# EAGLE design BP_demo_v5b (EAGLE 5.11)
OPT1: I2C; OPT2: SPI; OPT3: UART; OPT4: ____; PROJECT: Bus Pirate Demo Board v5b
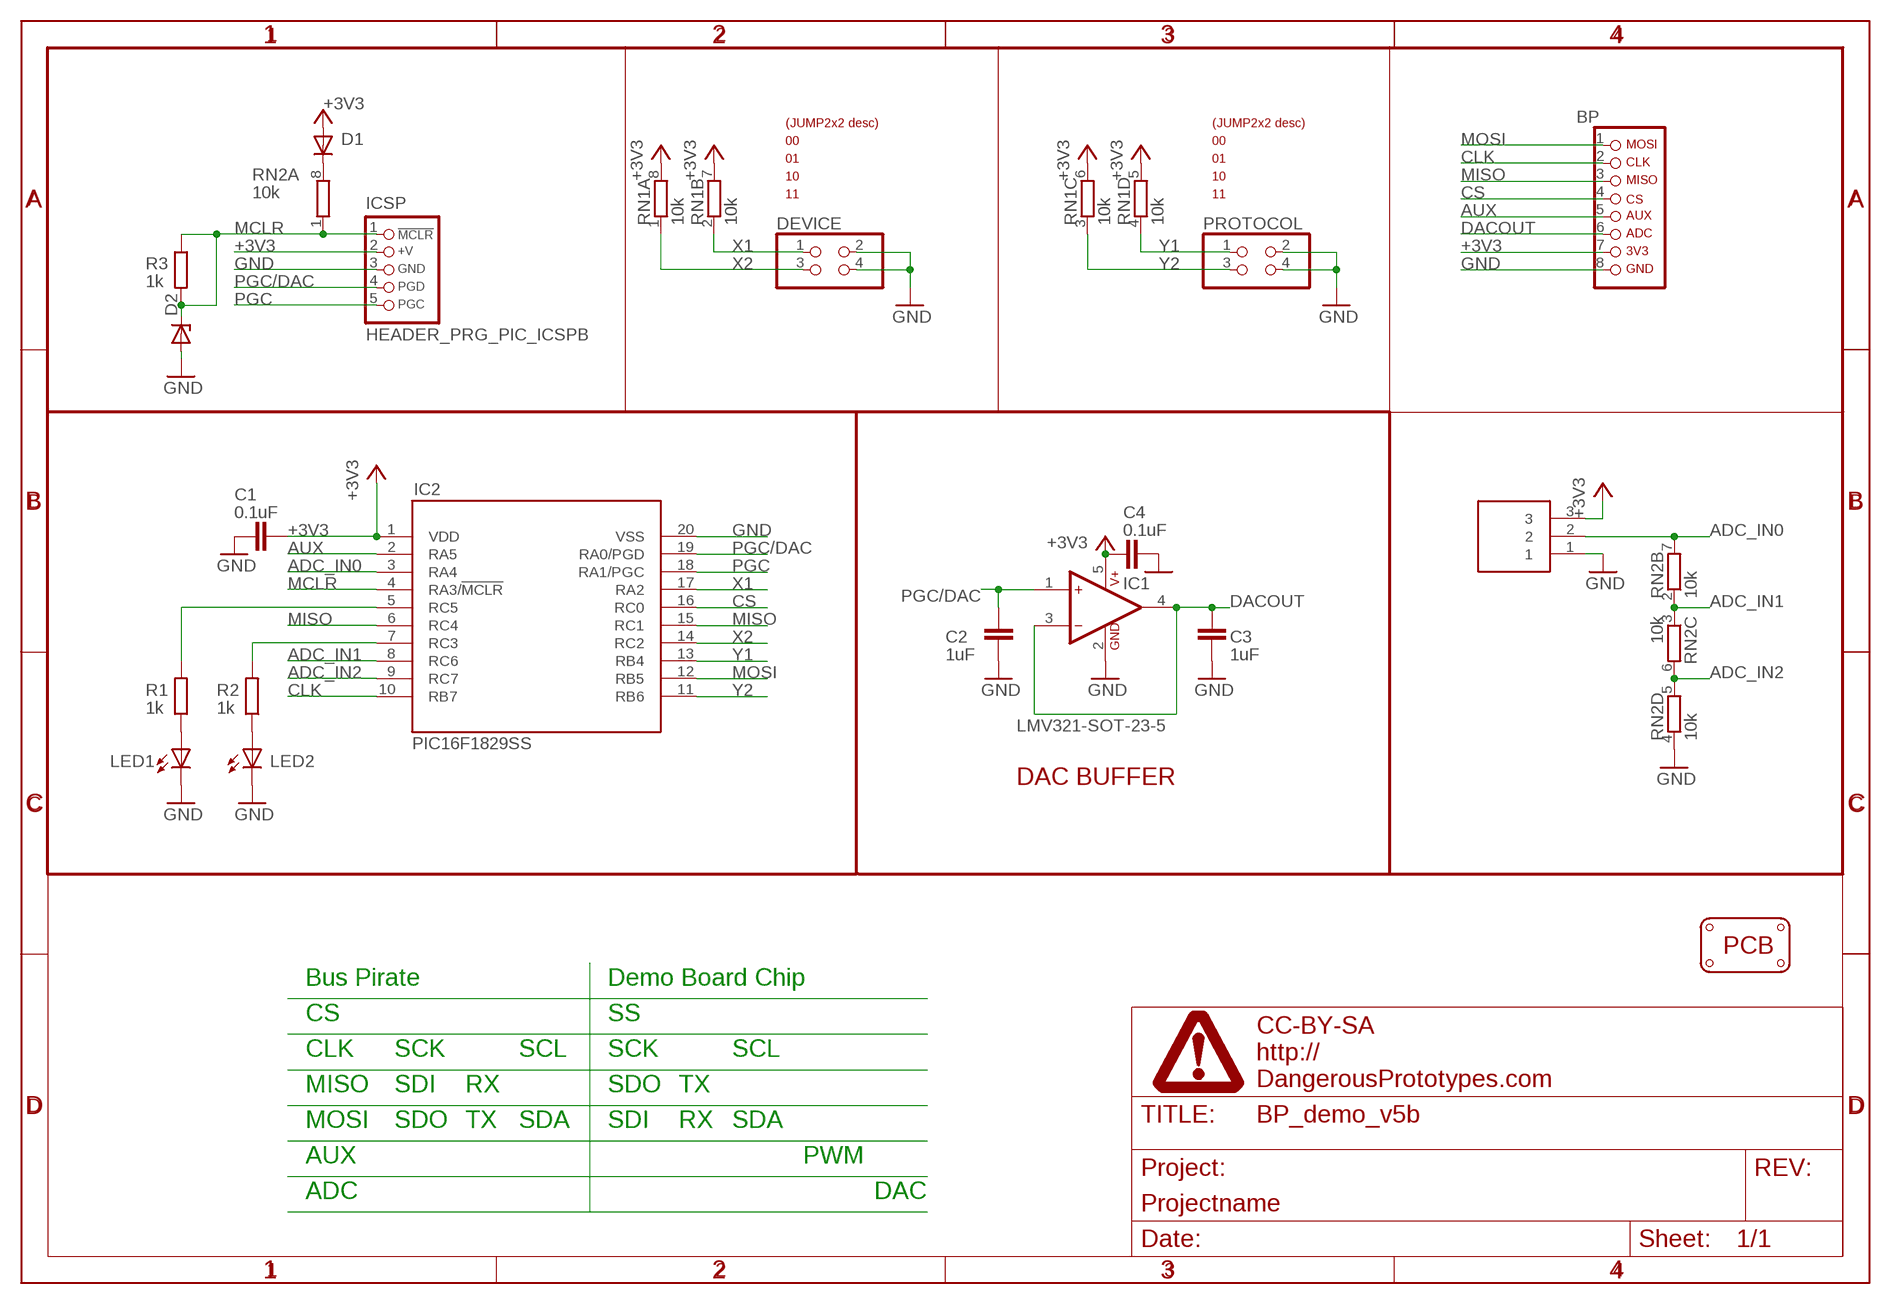
[diagram p0: schematic, sheet 1]

## Parts
ADC_IN  HEADER1X3PTH  [M1X3]
BP  HDR-BUSPIRATE  [HDR-BUSPIRATE]
C1  0.1uF  CAPC603  [C603]
C2  1uF  CAPC603  [C603]
C3  1uF  CAPC603  [C603]
C4  0.1uF  CAPC603  [C603]
D1  DIODE-DO323  [DO323]
D2  ZENERSOD-323F  [SOD-323F]
DEVICE  PINHD-2X2  [2X02]
IC1  LMV321-SOT-23-5  [SOT-23-5]
IC2  PIC16F1829SS  [SSOP20]
ICSP  HEADER_PRG_PIC_ICSPB  [HEADER_PRG_1X05_ICSP_B]
LED1  LED805  [LED-805]
LED2  LED805  [LED-805]
PCB1  PCB_DP_RECTANGLE-37X60  [DP6037_V1]
PROTOCOL  PINHD-2X2  [2X02]
R1  1k  RESISTORR603  [R603]
R2  1k  RESISTORR603  [R603]
R3  1k  RESISTORR603  [R603]
RN1  10k  RNETWORK  [RN8P-4R-CRA06S]
RN2  10k  RNETWORK  [RN8P-4R-CRA06S]
U$2  DINA4_L  [DP_LOGO]
U$3  JUMP2X2_DESC  [JUMP2X2_DESC]
U$4  JUMP2X2_DESC  [JUMP2X2_DESC]

## Nets
+3V3: ADC_IN.3 BP.7 C1.1 C4.1 D1.A IC1.5(V+) IC2.1(VDD) ICSP.2(+V) RN1.5 RN1.6 RN1.7 RN1.8
ADC_IN0: ADC_IN.2 IC2.3(RA4) RN2.7
ADC_IN1: IC2.8(RC6) RN2.2 RN2.3
ADC_IN2: IC2.9(RC7) RN2.5 RN2.6
AUX: BP.5 IC2.2(RA5)
CLK: BP.2 IC2.10(RB7)
CS: BP.4 IC2.16(RC0)
DACOUT: BP.6 C3.1 IC1.3(-) IC1.4(OUT)
GND: ADC_IN.1 BP.8 C1.2 C2.1 C3.2 C4.2 D2.A DEVICE.2 DEVICE.4 IC1.2(GND) IC2.20(VSS) ICSP.3(GND) LED1.C LED2.C PROTOCOL.2 PROTOCOL.4 RN2.4
MCLR: D2.C IC2.4(RA3/!MCLR) ICSP.1(/MCLR) R3.1 R3.2 RN2.1
MISO: BP.3 IC2.6(RC4) IC2.15(RC1)
MOSI: BP.1 IC2.12(RB5)
N$1: IC2.5(RC5) R1.2
N$2: LED1.A R1.1
N$7: LED2.A R2.1
N$10: IC2.7(RC3) R2.2
N$11: D1.C RN2.8
PGC: IC2.18(RA1/PGC) ICSP.5(PGC)
PGC/DAC: C2.2 IC1.1(+) IC2.19(RA0/PGD) ICSP.4(PGD)
X1: DEVICE.1 IC2.17(RA2) RN1.2
X2: DEVICE.3 IC2.14(RC2) RN1.1
Y1: IC2.13(RB4) PROTOCOL.1 RN1.4
Y2: IC2.11(RB6) PROTOCOL.3 RN1.3

## Notes on the sheet
- DAC BUFFER
- Bus Pirate | Demo Board Chip
- CS | SS
- CLK | SCK | SCL | SCK | SCL
- MISO | SDI | RX | SDO | TX
- MOSI | SDO | TX | SDA | SDI | RX | SDA
- AUX | PWM
- ADC | DAC

## Library data of the parts
ADC_IN = dp_devices:HEADER1X3
BP = dp_devices:HDR-BUSPIRATE: PIN HEADER
C1-C4 = dp_devices:CAP
D1 = dp_devices:DIODE: Various Diode Packages
D2 = dp_devices:ZENER: Zener Diode SOD-323
DEVICE PROTOCOL = pinhead:PINHD-2X2: PIN HEADER
IC1 = dp_devices:LMV321: Low voltage op-amp (2.7 - 5.0V)
IC2 = dp_devices:PIC16F1829
ICSP = dp_devices:HEADER_PRG_PIC_ICSP: 5-pin PIC In Circuit Serial Programming header
LED1 LED2 = dp_devices:LED
PCB1 = dp_devices:PCB_DP_RECTANGLE: Dangerous Prototypes Standard Rectangular PCB sizes
R1-R3 = dp_devices:RESISTOR
RN1 RN2 = dp_devices:RNETWORK: 4 Resistor Array 0603
U$2 = DP2:DINA4_L: A4 DP frame Standard Dangerous Prototypes schematic frame. Automagically adds the DP logo and standard texts to the PCB Use the atrribute in the schematic editor to change the fields.; FF1: fulfillment by; FF2: Seeed Studio; FF3: www.seeedstudio.com; LICENSE: CC-BY-SA; PROJECT: Projectname; URL1: http://; URL2: DangerousPrototypes.com
U$3 U$4 = DP2:JUMP2X2_DESC; OPT1: option1; OPT2: option2; OPT3: option3; OPT4: option4

## Board
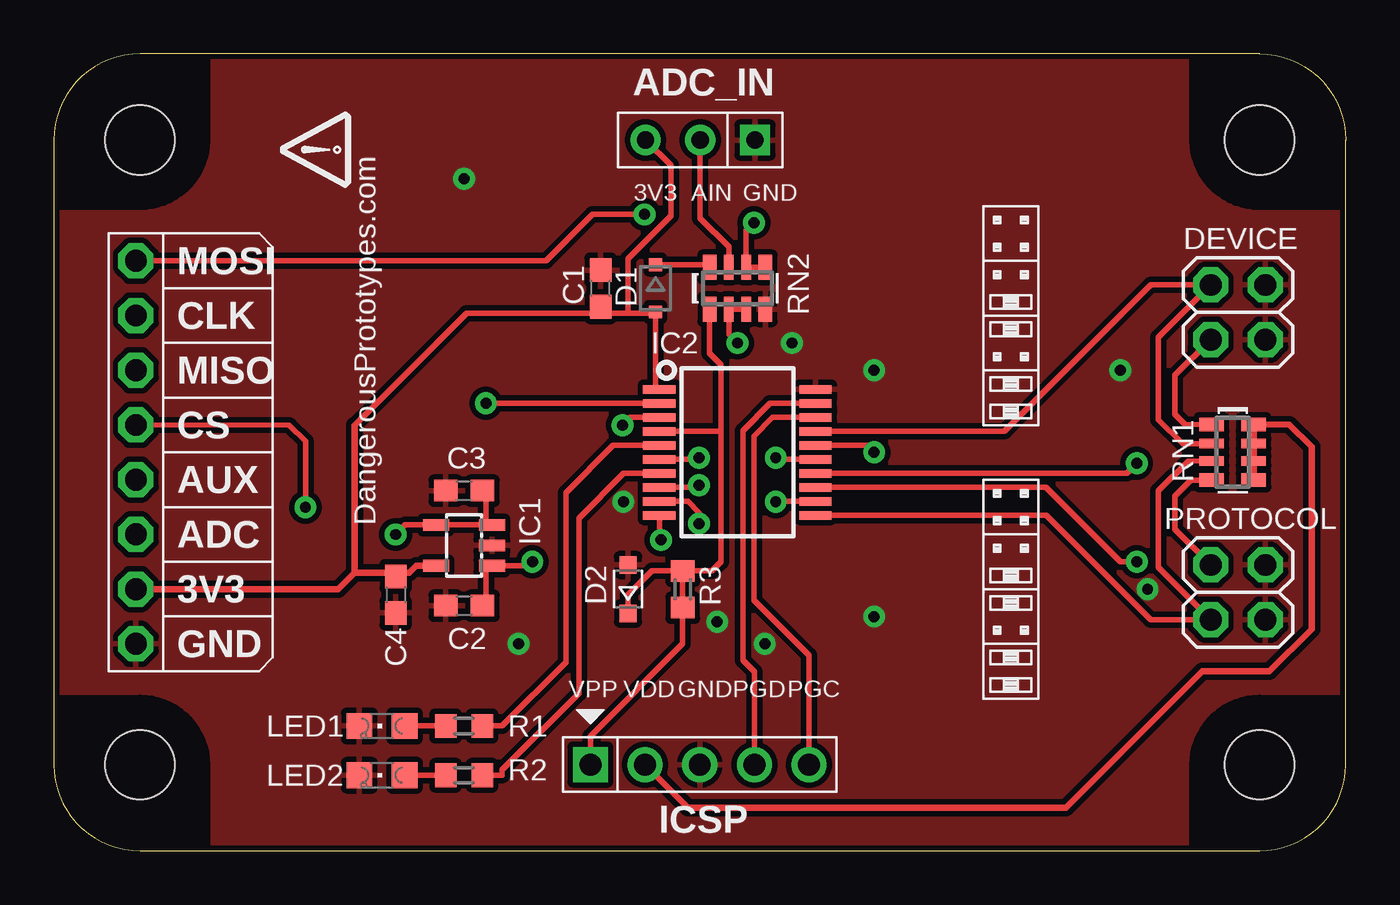
[diagram p1: board, top side]
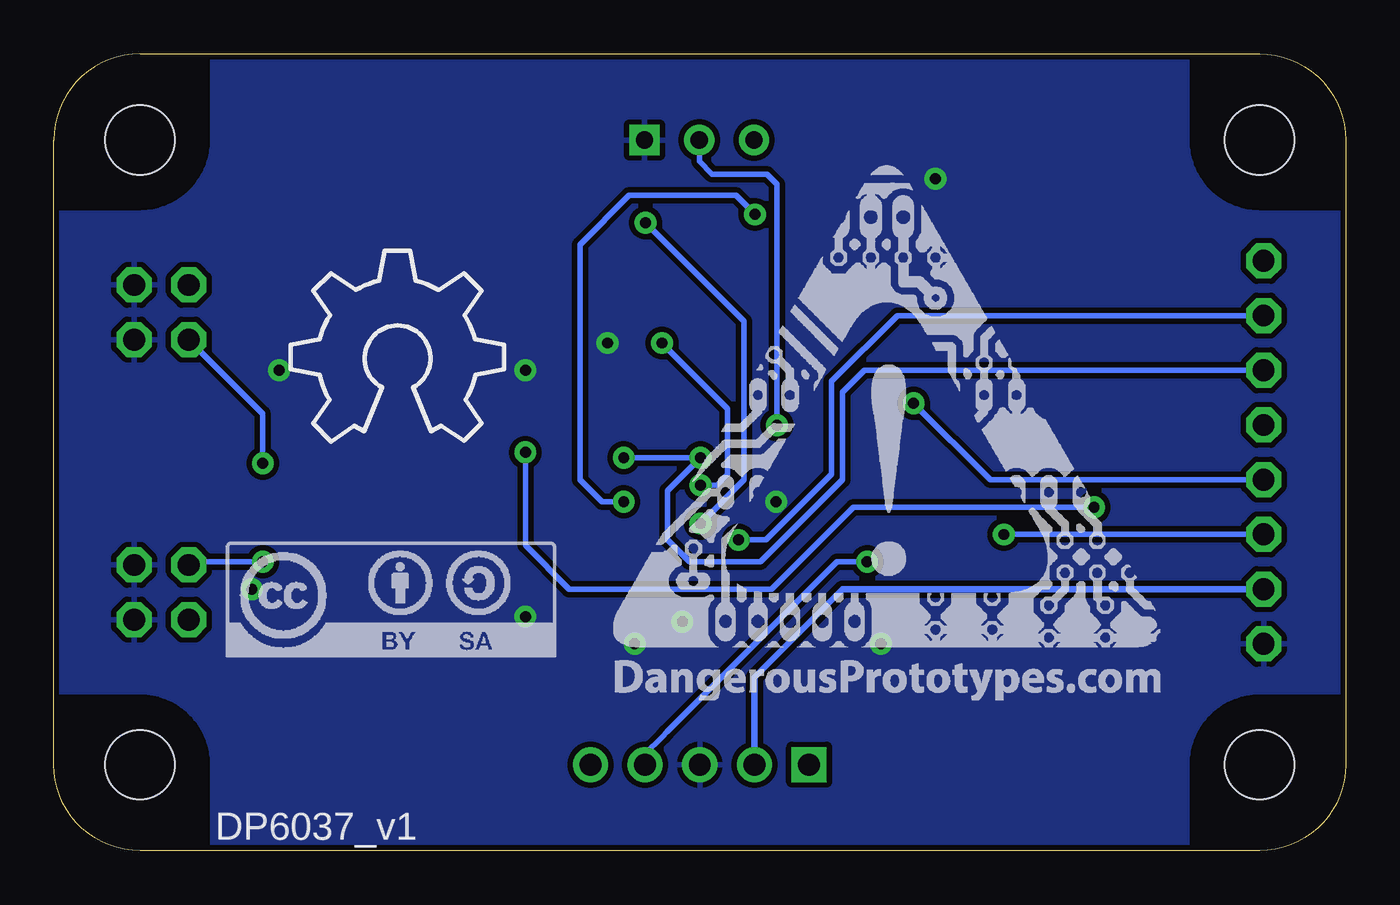
[diagram p2: board, bottom side, seen from below]

Size 60 x 37 mm. Coordinates in mm from the lower left corner, seen from the top.
Copper layers (1*16): Top 0.035mm / dielectric 1.5mm / Bottom 0.035mm
Design rules "SparkFun": minimum track width 8mil, minimum drill 20mil, track to track 8mil, track to pad 8mil, pad to pad 8mil, via to via 8mil, smd to smd 8mil, copper to edge 10mil, drill to drill 8mil, minimum pad ring 12mil, minimum via ring 10mil, stop-mask expansion 4mil, vias tented up to drill 25mil, thermal gap 10mil

### Footprints (pad centres in the part's own frame; a part is rotated, then mirrored left to right if it is on the bottom)
M1X3 = drill 0.8 square: 1 0,0 | drill 0.8 round: 2 2.54,0; 3 5.08,0
HDR-BUSPIRATE = drill 1.016 octagon: 1 -8.89,0; 2 -6.35,0; 3 -3.81,0; 4 -1.27,0; 5 1.27,0; 6 3.81,0; 7 6.35,0; 8 8.89,0
C603 = smd 1.1 x 1: 1 -0.85,0; 2 0.85,0
DO323 = smd 0.6 x 0.6: A 1.1,0; C -1.1,0
SOD-323F = smd 0.8 x 0.8: A 1.125,0; C -1.125,0
2X02 = drill 1.016 octagon: 1 -1.27,-1.27; 2 -1.27,1.27; 3 1.27,-1.27; 4 1.27,1.27
SOT-23-5 = smd 0.55 x 1.2: 1 -0.95,-1.3; 2 0,-1.3; 3 0.95,-1.3; 4 0.95,1.3; 5 -0.95,1.3
SSOP20 = smd 0.4 x 1.5: 1 -2.925,-3.625; 2 -2.275,-3.625; 3 -1.625,-3.625; 4 -0.975,-3.625; 5 -0.325,-3.625; 6 0.325,-3.625; 7 0.975,-3.625; 8 1.625,-3.625; 9 2.275,-3.625; 10 2.925,-3.625; 11 2.925,3.625; 12 2.275,3.625; 13 1.625,3.625; 14 0.975,3.625; 15 0.325,3.625; 16 -0.325,3.625; 17 -0.975,3.625; 18 -1.625,3.625; 19 -2.275,3.625; 20 -2.925,3.625
HEADER_PRG_1X05_ICSP_B = drill 1.016 square: 1 -5.08,0 | drill 1.016 round: 2 -2.54,0; 3 0,0; 4 2.54,0; 5 5.08,0
LED-805 = smd 1.2 x 1.2: A 0,-1.05; C 0,1.05
DP6037_V1 = hole 3.2: 4,4; 56,4; 56,33; 4,33
R603 = smd 1 x 1.1: 1 -0.85,0; 2 0.85,0
RN8P-4R-CRA06S = smd 0.63 x 1.15: 1 -1.295,-0.975; 4 1.295,-0.975; 5 1.295,0.975; 8 -1.295,0.975 | smd 0.44 x 1.15: 2 -0.4,-0.975; 3 0.4,-0.975; 6 0.4,0.975; 7 -0.4,0.975

### Placement (x,y rotation side)
ADC_IN  32.56,33 180 top
BP  3.81,18.5 270 top
C1  25.4,26.11 90 top
C2  19.05,11.38 0 top
C3  19.05,16.72 180 top
C4  15.88,11.89 270 top
D1  27.94,26.11 270 top
D2  26.67,12.15 90 top
DEVICE  55,25 270 top
IC1  19.05,14.18 90 top
IC2  31.75,18.49 270 top
ICSP  30,4 0 top
LED1  15.24,5.79 90 top
LED2  15.24,3.51 90 top
PCB1  0,0 0 top
PROTOCOL  55,12 270 top
R1  19.05,5.79 0 top
R2  19.05,3.51 0 top
R3  29.21,12.14 90 top
RN1  54.75,18.5 270 top
RN2  31.75,26.11 0 top
U$1  [DP_LOGO_ART_1X1]  34,7 0 bottom
U$2  13.16,32.55 90 top
U$3  46.99,25.48 0 top
U$4  46.99,12.78 0 top
U$5  [OSHW_8X350_NOTEXT]  49,19 0 bottom
U$6  [CC-BY-SA]  52,9 0 bottom

### Tracks (layer width: path | path; a pad name or v marks a point on that pad's centre or on a via)
+3V3
  Top 0.254: 13.97,19.76 19.17,24.97 25.4,24.97 | 25.4,24.97 26.67,24.97 | 26.67,24.97 27.94,24.97 D1.A 27.94,22.3 27.94,21.42 | 26.67,24.97 26.67,27.48 28.67,29.48 28.67,31.82 ADC_IN.3 | C1.1 | 25.4,24.97 C1.1
  Top 0.305: RN1.5 RN1.6 RN1.7 RN1.8 57.38,19.79 58.42,18.75 58.42,10.29 56.46,8.33 53.33,8.33 47,2 29.46,2 ICSP.2 | 27.94,21.42 IC2.1 | BP.7 13.21,12.14 13.97,12.91 | IC1.5 16.83,13.23 16.51,12.91 16.04,12.91 C4.1 15.88,12.78 16,12.91 13.97,12.91 | 13.97,12.91 13.97,19.76
  Bottom 0.305: BP.7 23.37,12.14 27.46,8.05 ICSP.2
ADC_IN0  (via drill 0.51)
  Top 0.254: RN2.7 31.35,28.04 30.02,29.37 ADC_IN.2 | IC2.3 26.77,20.12 v26.42,19.76
  Bottom 0.254: v26.42,19.76 26.42,30.94 26.88,31.41 29.42,31.41 30.02,32.01 ADC_IN.2
ADC_IN1  (via drill 0.51)
  Top 0.254: RN2.3 RN2.2 31.35,23.97 v31.75,23.57 | v29.97,16.97 29.87,16.87 IC2.8
  Bottom 0.254: v31.75,23.57 28.7,20.53 28.7,17.48 29.21,16.97 v29.97,16.97
ADC_IN2  (via drill 0.51)
  Top 0.254: RN2.5 RN2.6 32.15,28.8 v32.51,29.16 | v29.97,15.19 29.97,15.7 29.45,16.22 IC2.9
  Bottom 0.254: v32.51,29.16 27.94,24.59 27.94,17.22 v29.97,15.19
AUX  (via drill 0.51)
  Top 0.254: IC2.2 21.07,20.77 v20.07,20.78
  Bottom 0.254: v20.07,20.78 16.51,17.22 BP.5
CLK  (via drill 0.51)
  Top 0.254: IC2.10 28.12,14.5 v28.19,14.43
  Bottom 0.254: v28.19,14.43 26.92,14.43 23.88,17.48 23.88,21.8 20.83,24.84 BP.2
CS  (via drill 0.51)
  Top 0.254: BP.4 10.92,19.76 11.68,19 v11.68,15.95 | IC2.16 37.77,18.82 v38.1,18.49
  Bottom 0.254: v11.68,15.95 22.86,15.95 26.67,12.14 36.07,12.14 38.1,14.18 v38.1,18.49
DACOUT  (via drill 0.51)
  Top 0.254: v15.88,14.68 16.32,15.13 IC1.4 19.81,15.13 | 19.81,15.13 IC1.3 | C3.1 20.07,16.72 20.07,15.38 19.81,15.13
  Top 0.305: IC1.3 20.07,15.13 20.07,15.19
  Bottom 0.254: BP.6 v15.88,14.68
GND  (via drill 0.51)
  other vias: 38.1,22.3 34.29,23.57 38.1,10.87 21.59,9.6 19.05,31.19 26.45,16.21 30.81,10.63 49.53,22.3 33.02,9.6 50.8,12.14
  pour Bottom (isolate 0.254): 0,0 60,0 60,37 0,37
  pour Top (isolate 0.254): 0,0 60,0 60,37 0,37
MCLR
  Top 0.254: 30.99,19.51 30.99,22.56 30.45,23.09 RN2.1 | IC2.4 30.95,19.47 30.99,19.51 | 30.99,19.51 30.99,19.5 30.99,13.41 30.57,12.99 R3.2 | R3.2 27.77,12.99 26.67,11.89 D2.C | R3.2 R3.1 29.21,9.6 24.92,5.31 ICSP.1
MISO  (via drill 0.51)
  Top 0.254: IC2.6 29.9,18.17 v29.97,18.24 | v33.53,18.24 33.6,18.17 IC2.15
  Bottom 0.254: v33.53,18.24 v29.97,18.24 31.5,16.72 31.5,14.43 30.48,13.41 27.18,13.41 23.37,17.22 23.37,21.29 22.35,22.3 BP.3
MOSI  (via drill 0.51)
  Top 0.254: IC2.12 v33.54,16.22 v33.53,16.21 | BP.1 22.86,27.38 25.02,29.54 v27.43,29.54
  Bottom 0.254: v33.53,16.21 34.54,16.21 35.56,17.22 35.56,28.15 33.27,30.43 28.32,30.43 v27.43,29.54
N$1
  Top 0.254: IC2.5 25.98,18.82 23.79,16.63 23.79,8.75 20.83,5.79 R1.2
N$2
  Top 0.254: LED1.A R1.1
N$7
  Top 0.254: LED2.A R2.1
N$10
  Top 0.254: IC2.7 26.46,17.52 24.38,15.45 24.38,7.32 20.83,3.76 20.83,3.51 R2.2
N$11
  Top 0.254: D1.C 30.45,27.21 RN2.8
PGC
  Top 0.254: IC2.18 33.38,20.12 32.51,19.26 32.51,11.64 35.08,9.07 ICSP.5
PGC/DAC  (via drill 0.51)
  Top 0.254: C2.2 20.07,11.55 20.07,13.16 20.13,13.23 IC1.1 22.04,13.23 v22.23,13.41 | IC2.19 33.26,20.77 32,19.51 32,8.84 32.54,8.31 ICSP.4
  Bottom 0.254: v22.23,13.41 23.62,13.41 31.52,5.52 31.73,5.3 32.54,4.5 ICSP.4
X1
  Top 0.254: RN1.2 52.43,18.89 51.31,20.02 51.31,23.85 DEVICE.1 50.96,26.27 44.16,19.47 IC2.17
X2  (via drill 0.51)
  Top 0.254: RN1.1 52.55,19.79 52.07,20.27 52.07,22.07 DEVICE.3 | IC2.14 49.83,17.52 v50.29,17.99
  Bottom 0.254: v50.29,17.99 50.29,20.29 DEVICE.3
Y1  (via drill 0.51)
  Top 0.254: RN1.4 52.81,17.2 52.07,16.46 52.07,14.93 PROTOCOL.1 | IC2.13 46.08,16.87 49.53,13.41 v50.29,13.41
  Bottom 0.254: v50.29,13.41 53.59,13.41 PROTOCOL.1
Y2
  Top 0.254: RN1.3 52.69,18.09 51.31,16.72 51.31,13.15 PROTOCOL.3 50.94,10.73 46.1,15.57 IC2.11

### Text on the board
tNames: 3V3 | AIN | GND | DangerousPrototypes.com | VPP | VDD | GND | PGD | PGC